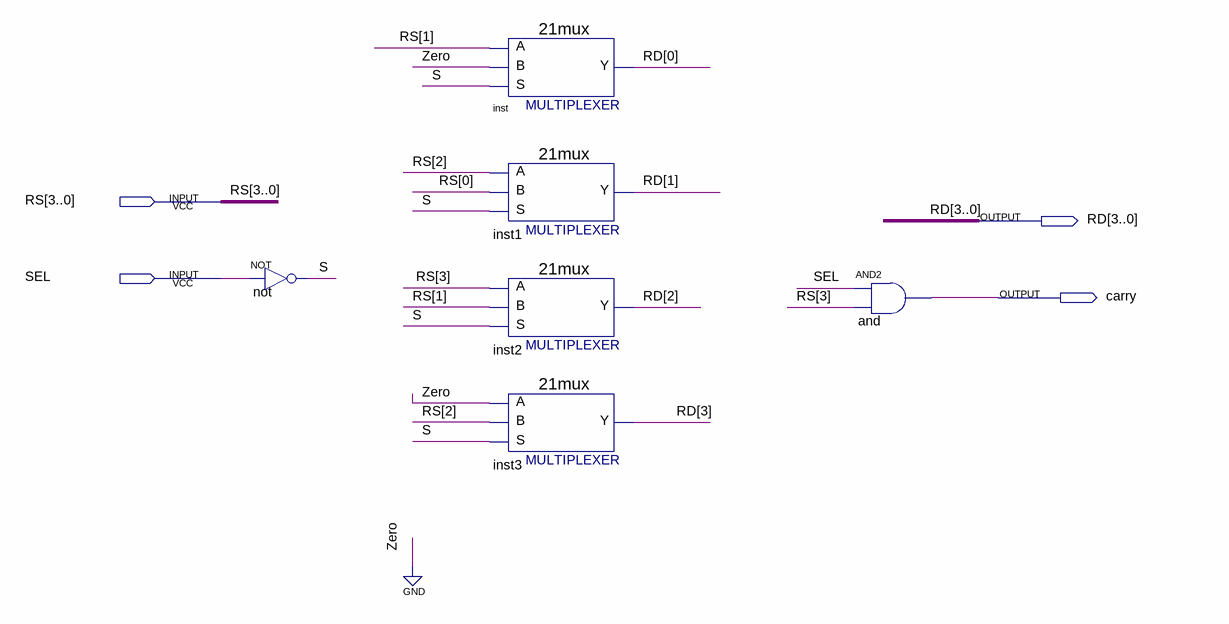
[diagram p0: schematic sheet]
// Quartus schematic Group03_2023510056_ALU_SHIFT.bdf as structural Verilog: 6 symbols, 4 pins
module Group03_2023510056_ALU_SHIFT (
  input  [3:0] RS,
  input  SEL,
  output [3:0] RD,
  output carry
);

  wire S;

  not \not  (S, SEL);
  \21mux  inst (.S(S), .B(1'b0), .A(RS[1]), .Y(RD[0]));
  \21mux  inst1 (.S(S), .B(RS[0]), .A(RS[2]), .Y(RD[1]));
  \21mux  inst2 (.S(S), .B(RS[1]), .A(RS[3]), .Y(RD[2]));
  \21mux  inst3 (.S(S), .B(RS[2]), .A(1'b0), .Y(RD[3]));
  and \and  (carry, SEL, RS[3]);
endmodule
